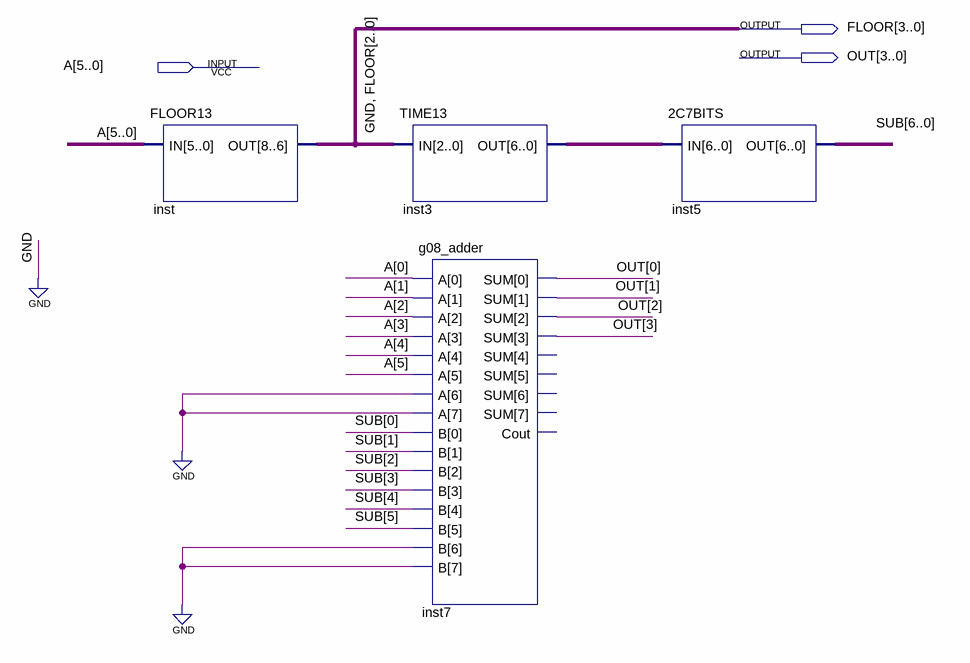
[diagram p0: schematic sheet]
// Quartus schematic MOD13.bdf as structural Verilog: 4 symbols, 3 pins
module MOD13 (
  input  [5:0] A,
  output [3:0] FLOOR,
  output [3:0] OUT
);

  wire GND;
  wire [6:0] inst3_out, SUB;
  wire [7:0] inst7_sum_open;  // unused outputs

  FLOOR13 inst (.IN(A), .OUT({GND, FLOOR[2:0]}));
  TIME13 inst3 (.IN({GND, FLOOR[2:0]}), .OUT(inst3_out));
  g08_adder inst7 (.A({2'b00, A}), .B({2'b00, SUB[5:0]}), .SUM({inst7_sum_open[7:4], OUT}));  // open: Cout
  \2C7BITS  inst5 (.IN(inst3_out), .OUT(SUB));
  // also tied to GND on the sheet: GND
endmodule
